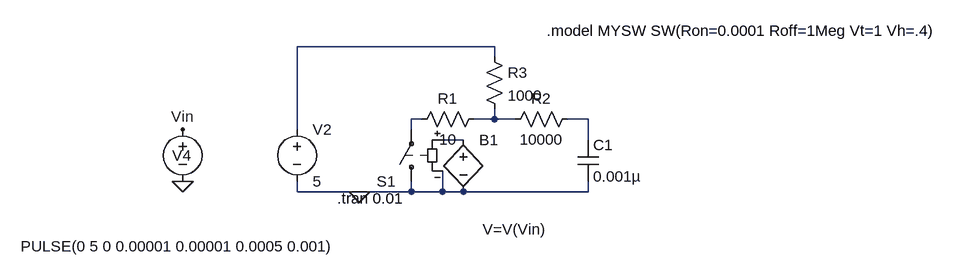
[diagram p0: schematic hall_filter.asc]
hall_filter.asc, the LTspice schematic file:
Version 4
SHEET 1 940 680
WIRE 208 0 -96 0
WIRE 208 16 208 0
WIRE 96 112 80 112
WIRE 208 112 208 96
WIRE 208 112 176 112
WIRE 240 112 208 112
WIRE 352 112 320 112
WIRE -96 128 -96 0
WIRE 80 128 80 112
WIRE 160 144 128 144
WIRE 352 144 352 112
WIRE -96 224 -96 208
WIRE 0 224 -96 224
WIRE 80 224 80 208
WIRE 80 224 0 224
WIRE 128 224 128 192
WIRE 128 224 80 224
WIRE 160 224 128 224
WIRE 352 224 352 208
WIRE 352 224 160 224
FLAG 0 224 0
FLAG -272 208 0
FLAG -272 128 Vin
SYMBOL res 192 96 R90
WINDOW 0 0 56 VBottom 2
WINDOW 3 32 56 VTop 2
SYMATTR InstName R1
SYMATTR Value 10
SYMBOL res 336 96 R90
WINDOW 0 0 56 VBottom 2
WINDOW 3 32 56 VTop 2
SYMATTR InstName R2
SYMATTR Value 10000
SYMBOL cap 336 144 R0
SYMATTR InstName C1
SYMATTR Value 0.001µ
SYMBOL res 192 0 R0
SYMATTR InstName R3
SYMATTR Value 1000
SYMBOL voltage -96 112 R0
WINDOW 123 0 0 Left 0
WINDOW 39 0 0 Left 0
SYMATTR InstName V2
SYMATTR Value 5
SYMBOL voltage -272 112 R0
WINDOW 0 -16 56 Left 2
WINDOW 3 -249 196 Left 2
WINDOW 123 0 0 Left 0
WINDOW 39 0 0 Left 0
SYMATTR InstName V4
SYMATTR Value PULSE(0 5 0 0.00001 0.00001 0.0005 0.001)
SYMBOL bv 160 128 R0
WINDOW 3 30 154 Left 2
SYMATTR InstName B1
SYMATTR Value V=V(Vin)
SYMBOL sw 80 224 R180
SYMATTR InstName S1
SYMATTR Value ""
SYMATTR SpiceModel MYSW
TEXT -34 234 Left 2 !.tran 0.01
TEXT 288 -24 Left 2 !.model MYSW SW(Ron=0.0001 Roff=1Meg Vt=1 Vh=.4)

The netlist it stands for:
* hall_filter.asc
R1 N003 N002 10
R2 N004 N003 10000
C1 N004 0 0.001µ
R3 N001 N003 1000
V2 N001 0 5
V4 Vin 0 PULSE(0 5 0 0.00001 0.00001 0.0005 0.001)
B1 N005 0 V=V(Vin)
S1 0 N002 N005 0 MYSW
.tran 0.01
.model MYSW SW(Ron=0.0001 Roff=1Meg Vt=1 Vh=.4)
.backanno
.end